# Altium project CW308T_PSoC62.PrjPcb
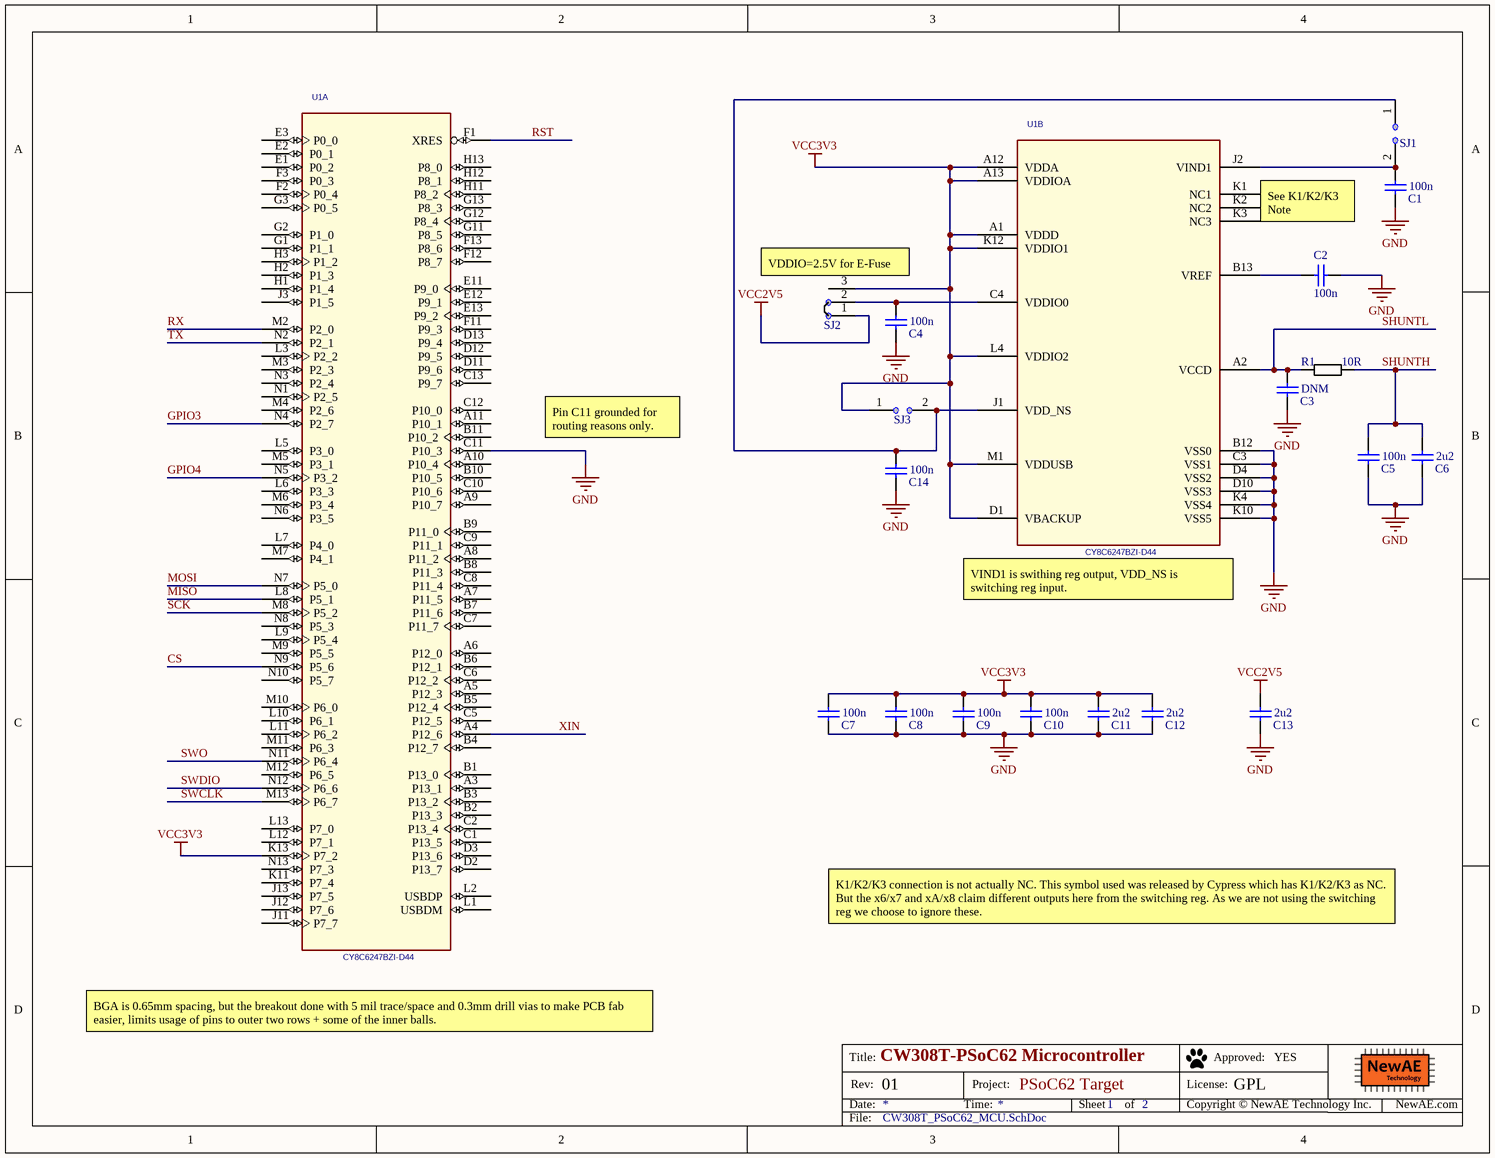
[diagram p0: CW308T_PSoC62_MCU.SchDoc]
PrjLicense: GPL; PrjName: PSoC62 Target; PrjRev: 01
2 sheets, 22 parts. Net scope: global (net labels, ports and power ports of the same name join across sheets).
Board files: CW308T_PSoC62.PcbDoc, CW308T_PSoC62_PANEL.PcbDoc
Sheets:
  CW308T_PSoC62_MCU.SchDoc
  CW308T_PSoC62_UFO.SchDoc

## Sheet CW308T_PSoC62_MCU.SchDoc: CW308T-PSoC62 Microcontroller
size Letter; Organization: NewAE Technology Inc.; Address1: 1083 Queen St., Suite 196; Address2: Halifax; Address3: NS; Address4: Canada B3H 0B2; SheetNumber: 1; SheetTotal: 2; SheetApproved: YES

### Parts
C1  100n  [CAPC0603_M]
C2  100n  [CAPC0603_M]
C3  DNM  [CAPC0603_M]
C4  100n  [CAPC0603_M]
C5  100n  [CAPC0603_M]
C6  2u2  [CAPC0603_M]
C7  100n  [CAPC0603_M]
C8  100n  [CAPC0603_M]
C9  100n  [CAPC0603_M]
C10  100n  [CAPC0603_M]
C11  2u2  [CAPC0603_M]
C12  2u2  [CAPC0603_M]
C13  2u2  [CAPC0603_M]
C14  100n  [CAPC0603_M]
R1  10R  [RESC1608X55N]
SJ1  NO  [SJ_2S_NO]  (value not drawn)  (no BOM)
SJ2  NC  [SJ_3S_NC12]  (value not drawn)  (no BOM)
SJ3  NO  [SJ_2S_NO]  (value not drawn)  (no BOM)
U1  CY8C6247BZI-D44  [BGA124C65P13X13_900X900X100]  (parts A,B of 2)

### Nets
GND: C1.2 C2.2 C3.2 C4.2 C5.2 C6.2 C7.2 C8.2 C9.2 C10.2 C11.2 C12.2 C13.2 C14.2 U1.B12(VSS0) U1.C3(VSS1) U1.C11(P10_3) U1.D4(VSS2) U1.D10(VSS3) U1.K4(VSS4) U1.K10(VSS5)
VCC2V5: C13.1 SJ2.1
VCC3V3: C7.1 C8.1 C9.1 C10.1 C11.1 C12.1 SJ2.3 SJ3.1 U1.A1(VDDD) U1.A12(VDDA) U1.A13(VDDIOA) U1.D1(VBACKUP) U1.K12(VDDIO1) U1.K13(P7_2) U1.L4(VDDIO2) U1.M1(VDDUSB)
CS: U1.N9(P5_6)
GPIO3: U1.N4(P2_7)
GPIO4: U1.N5(P3_2)
MISO: U1.L8(P5_1)
MOSI: U1.N7(P5_0)
RST: U1.F1(XRES)
RX: U1.M2(P2_0)
SCK: U1.M8(P5_2)
SHUNTH: C5.1 C6.1 R1.2
SHUNTL: C3.1 R1.1 U1.A2(VCCD)
SWCLK: U1.M13(P6_7)
SWDIO: U1.N12(P6_6)
SWO: U1.N11(P6_4)
TX: U1.N2(P2_1)
XIN: U1.A4(P12_6)
NetC1_1: C1.1 SJ1.2 U1.J2(VIND1)
NetC2_1: C2.1 U1.B13(VREF)
NetC4_1: C4.1 SJ2.2 U1.C4(VDDIO0)
NetC14_1: C14.1 SJ1.1 SJ3.2 U1.J1(VDD_NS)

Not connected (* = marked no-connect by the designer): U1 A3(P13_1) A5(P12_3) A6(P12_0) A7(P11_5) A8(P11_2) A9(P10_7) A10(P10_4) A11(P10_1) B1(P13_0) B2(P13_3) B3(P13_2) B4(P12_7) B5(P12_4) B6(P12_1) B7(P11_6) B8(P11_3) B9(P11_0) B10(P10_5) B11(P10_2) C1(P13_5) C2(P13_4) C5(P12_5) C6(P12_2) C7(P11_7) C8(P11_4) C9(P11_1) C10(P10_6) C12(P10_0) C13(P9_7) D2(P13_7) D3(P13_6) D11(P9_6) D12(P9_5) D13(P9_4) E1(P0_2) E2(P0_1) E3(P0_0) E11(P9_0) E12(P9_1) E13(P9_2) F2(P0_4) F3(P0_3) F11(P9_3) F12(P8_7) F13(P8_6) G1(P1_1) G2(P1_0) G3(P0_5) G11(P8_5) G12(P8_4) G13(P8_3) H1(P1_4) H2(P1_3) H3(P1_2) H11(P8_2) H12(P8_1) H13(P8_0) J3(P1_5) J11(P7_7) J12(P7_6) J13(P7_5) K1(NC1) K2(NC2) K3(NC3) K11(P7_4) L1(USBDM) L2(USBDP) L3(P2_2) L5(P3_0) L6(P3_3) L7(P4_0) L9(P5_4) L10(P6_1) L11(P6_2) L12(P7_1) L13(P7_0) M3(P2_3) M4(P2_6) M5(P3_1) M6(P3_4) M7(P4_1) M9(P5_5) M10(P6_0) M11(P6_3) M12(P6_5) N1(P2_5) N3(P2_4) N6(P3_5) N8(P5_3) N10(P5_7) N13(P7_3)

### Notes on the sheet
- See K1/K2/K3 Note
- (near SJ2) VDDIO=2.5V for E-Fuse
- Pin C11 grounded for routing reasons only.
- (near U1) VIND1 is swithing reg output, VDD_NS is switching reg input.
- K1/K2/K3 connection is not actually NC. This symbol used was released by Cypress which has K1/K2/K3 as NC. But the x6/x7 and xA/x8 claim different outputs here from the switching reg. As we are not using the switching reg we choose to ignore these.
- BGA is 0.65mm spacing, but the breakout done with 5 mil trace/space and 0.3mm drill vias to make PCB fab easier, limits usage of pins to outer two rows + some of the inner balls.
- Title:
- Date:
- Rev:
- Time:
- Project:
- Sheet
- of
- License:
- Copyright © NewAE Technology Inc.
- Approved:
- NewAE.com
- File:

### Library data of the parts
C1 C2 C4 C5 C7-C10 C14 = CCHIP-100n-0603: 100n, 0603; Manufacture 1: Kemet; Manufacture Part Number 1: C0603C104K5RACTU; Component Group: Capacitor; Case-EIA: 0603; Case-Metric: 1608; Rated Voltage: 50VDC; Part Number: CCHIP-100n-0603; Footprint: 0603; Pin Count: 2; Supplier 1: Digi-Key; Supplier Part Number 1: 399-5089-2-ND; Value: 100n; Mounting Technology: SMT; Component Kind: Standard; Component Type: Standard
C3 = CCHIP-DNM-0603: DNM, 0603; Component Group: Capacitor; Case-EIA: 0603; Part Number: CCHIP-DNM-0603; Footprint: 0603; Pin Count: 2; Value: DNM; Mounting Technology: SMT; Component Kind: Standard; Component Type: Standard
C6 C11-C13 = CCHIP-2u2-0603: 2u2, 0603; Manufacture 1: Samsung; Manufacture Part Number 1: CL10B225KP8NNNC; Component Group: Capacitor; Case-EIA: 0603; Case-Metric: 1608; Rated Voltage: 10VDC; Part Number: CCHIP-2u2-0603; Footprint: 0603; Pin Count: 2; Supplier 1: Digi-Key; Supplier Part Number 1: 1276-1134-2-ND; Value: 2u2; Mounting Technology: SMT; Component Kind: Standard; Component Type: Standard
R1 = RCHIP-10R-0603: 10R res, 0603, 1%, 1/10W; Manufacture 1: Yageo; Manufacture Part Number 1: RC0603FR-0710RL; Component Group: Resistor; Case-EIA: 0603; Case-Metric: 1608; Rated Power: 0.1W; Rated Voltage: 75VDC; Part Number: RCHIP-10R-0603; Footprint: 0603; Pin Count: 2; Supplier 1: Digi-Key; Supplier Part Number 1: 311-10.0HRCT-ND; Value: 10R; Tolerance: 1%; Mounting Technology: SMT; Temperature Range: -55C to 155C; Component Kind: Standard; Component Type: Standard
SJ1 SJ3 = SJ_2S_NO: Solder Jumper, NO; Component Group: PCB Feature; Part Number: SJ_2S_NO; Pin Count: 2; Mounting Technology: COPPER; Component Type: Standard (No BOM)
SJ2 = SJ_3S_12JMP: Solder Jumper, NC; Component Group: PCB Feature; Part Number: SJ_3S_12JMP; Pin Count: 3; Mounting Technology: COPPER; Component Type: Standard (No BOM)
U1 = CY8C6246BZI-D04: IC DUAL CORE MCU 32B 512K 124BGA; Manufacture 1: Cypress Semiconductors; Component Group: Digital IC; PP Material Stack: 0; Part Number: CY8C6246BZI-D04; Footprint: BGA124; Manufacture Part Number 1: CY8C6246BZI-D04; Pin Count: 124; Supplier 1: Digi-Key; Supplier Part Number 1: CY8C6246BZI-D04; Mounting Technology: SMT; RoHS: Yes; Component Kind: Standard; Component Type: Standard; PP Rotation: 0

## Sheet CW308T_PSoC62_UFO.SchDoc: CW308T-PSOC62 UFO Connections
size Letter; Organization: NewAE Technology Inc.; Address1: 1083 Queen St., Suite 196; Address2: Halifax; Address3: NS; Address4: Canada B3H 0B2; SheetNumber: 2; SheetTotal: 2; SheetApproved: YES
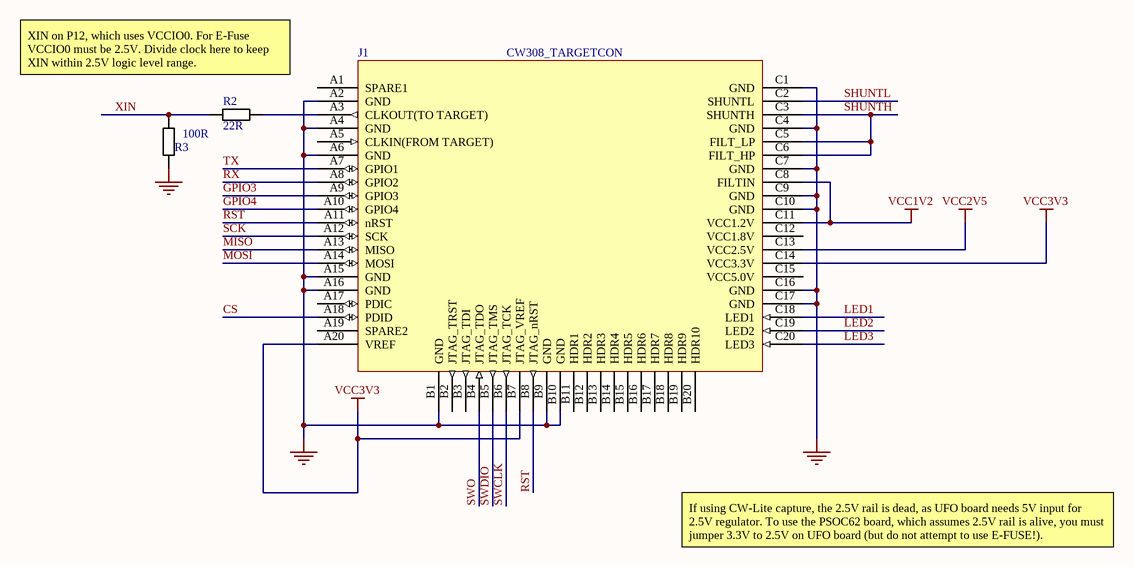
[diagram p1: CW308T_PSoC62_UFO.SchDoc]

### Parts
J1  CW308_TARGETCON  [CW308_TBOARD_CONN]
R2  22R  [RESC1608X55N]
R3  100R  [RESC1608X55N]

### Nets
GND: J1.A2(GND) J1.A4(GND) J1.A6(GND) J1.A15(GND) J1.A16(GND) J1.B1(GND) J1.B9(GND) J1.B10(GND) J1.C1(GND) J1.C4(GND) J1.C7(GND) J1.C9(GND) J1.C10(GND) J1.C16(GND) J1.C17(GND) R3.1
VCC1V2: J1.C8(FILTIN) J1.C11(VCC1.2V)
VCC2V5: J1.C13(VCC2.5V)
VCC3V3: J1.A20(VREF) J1.B7(JTAG_VREF) J1.C14(VCC3.3V)
CS: J1.A18(PDID)
GPIO3: J1.A9(GPIO3)
GPIO4: J1.A10(GPIO4)
LED1: J1.C18(LED1)
LED2: J1.C19(LED2)
LED3: J1.C20(LED3)
MISO: J1.A13(MISO)
MOSI: J1.A14(MOSI)
RST: J1.A11(nRST) J1.B8(JTAG_nRST)
RX: J1.A8(GPIO2)
SCK: J1.A12(SCK)
SHUNTH: J1.C3(SHUNTH) J1.C5(FILT_LP) J1.C6(FILT_HP)
SHUNTL: J1.C2(SHUNTL)
SWCLK: J1.B6(JTAG_TCK)
SWDIO: J1.B5(JTAG_TMS)
SWO: J1.B4(JTAG_TDO)
TX: J1.A7(GPIO1)
XIN: R2.1 R3.2
NetJ1_A3: J1.A3(CLKOUT(TO_TARGET)) R2.2

Not connected (* = marked no-connect by the designer): J1 A1(SPARE1) A5(CLKIN(FROM_TARGET)) A17(PDIC) A19(SPARE2) B2(JTAG_TRST) B3(JTAG_TDI) B11(HDR1) B12(HDR2) B13(HDR3) B14(HDR4) B15(HDR5) B16(HDR6) B17(HDR7) B18(HDR8) B19(HDR9) B20(HDR10) C12(VCC1.8V) C15(VCC5.0V)

### Notes on the sheet
- XIN on P12, which uses VCCIO0. For E-Fuse VCCIO0 must be 2.5V. Divide clock here to keep XIN within 2.5V logic level range.
- If using CW-Lite capture, the 2.5V rail is dead, as UFO board needs 5V input for 2.5V regulator. To use the PSOC62 board, which assumes 2.5V rail is alive, you must jumper 3.3V to 2.5V on UFO board (but do not attempt to use E-FUSE!).
- Title:
- Date:
- Rev:
- Time:
- Project:
- Sheet
- of
- License:
- Copyright © NewAE Technology Inc.
- Approved:
- NewAE.com
- File:

### Library data of the parts
J1 = CW308_TBOARD: CW308 "Standard" Target Board Connector; Component Group: Mechanical; Pitch: 2.54mm; Part Number: CW308_TBOARD; Pin Count: 60; Mounting Technology: Through-hole; Component Kind: Standard; Component Type: Standard
R2 = RCHIP-22R-0603: 22R res, 0603, 1%, 1/10W; Manufacture 1: Yageo; Manufacture Part Number 1: RC0603FR-0722RL; Component Group: Resistor; Case-EIA: 0603; Case-Metric: 1608; Rated Power: 0.1W; Rated Voltage: 75VDC; Part Number: RCHIP-22R-0603; Footprint: 0603; Pin Count: 2; Supplier 1: Digi-Key; Supplier Part Number 1: 311-22.0HRCT-ND; Value: 22R; Tolerance: 1%; Mounting Technology: SMT; Temperature Range: -55C to 155C; Component Kind: Standard; Component Type: Standard
R3 = RCHIP-100R-0603: 100R res, 0603, 1%, 1/10W; Manufacture 1: Yageo; Manufacture Part Number 1: RC0603FR-07100RL; Component Group: Resistor; Case-EIA: 0603; Case-Metric: 1608; Rated Power: 0.1W; Rated Voltage: 75VDC; Part Number: RCHIP-100R-0603; Footprint: 0603; Pin Count: 2; Supplier 1: Digi-Key; Supplier Part Number 1: 311-100HRCT-ND; Value: 100R; Tolerance: 1%; Mounting Technology: SMT; Temperature Range: -55C to 155C; Component Kind: Standard; Component Type: Standard

## Nets that join several sheets
GND: CW308T_PSoC62_MCU (21 pins), CW308T_PSoC62_UFO (16 pins)
VCC2V5: CW308T_PSoC62_MCU (C13.1 SJ2.1), CW308T_PSoC62_UFO (J1.C13)
VCC3V3: CW308T_PSoC62_MCU (16 pins), CW308T_PSoC62_UFO (J1.A20 J1.B7 J1.C14)
CS: CW308T_PSoC62_MCU (U1.N9), CW308T_PSoC62_UFO (J1.A18)
GPIO3: CW308T_PSoC62_MCU (U1.N4), CW308T_PSoC62_UFO (J1.A9)
GPIO4: CW308T_PSoC62_MCU (U1.N5), CW308T_PSoC62_UFO (J1.A10)
MISO: CW308T_PSoC62_MCU (U1.L8), CW308T_PSoC62_UFO (J1.A13)
MOSI: CW308T_PSoC62_MCU (U1.N7), CW308T_PSoC62_UFO (J1.A14)
RST: CW308T_PSoC62_MCU (U1.F1), CW308T_PSoC62_UFO (J1.A11 J1.B8)
RX: CW308T_PSoC62_MCU (U1.M2), CW308T_PSoC62_UFO (J1.A8)
SCK: CW308T_PSoC62_MCU (U1.M8), CW308T_PSoC62_UFO (J1.A12)
SHUNTH: CW308T_PSoC62_MCU (C5.1 C6.1 R1.2), CW308T_PSoC62_UFO (J1.C3 J1.C5 J1.C6)
SHUNTL: CW308T_PSoC62_MCU (C3.1 R1.1 U1.A2), CW308T_PSoC62_UFO (J1.C2)
SWCLK: CW308T_PSoC62_MCU (U1.M13), CW308T_PSoC62_UFO (J1.B6)
SWDIO: CW308T_PSoC62_MCU (U1.N12), CW308T_PSoC62_UFO (J1.B5)
SWO: CW308T_PSoC62_MCU (U1.N11), CW308T_PSoC62_UFO (J1.B4)
TX: CW308T_PSoC62_MCU (U1.N2), CW308T_PSoC62_UFO (J1.A7)
XIN: CW308T_PSoC62_MCU (U1.A4), CW308T_PSoC62_UFO (R2.1 R3.2)